# EAGLE design RAK4260_WCharging (EAGLE 9.6.2)
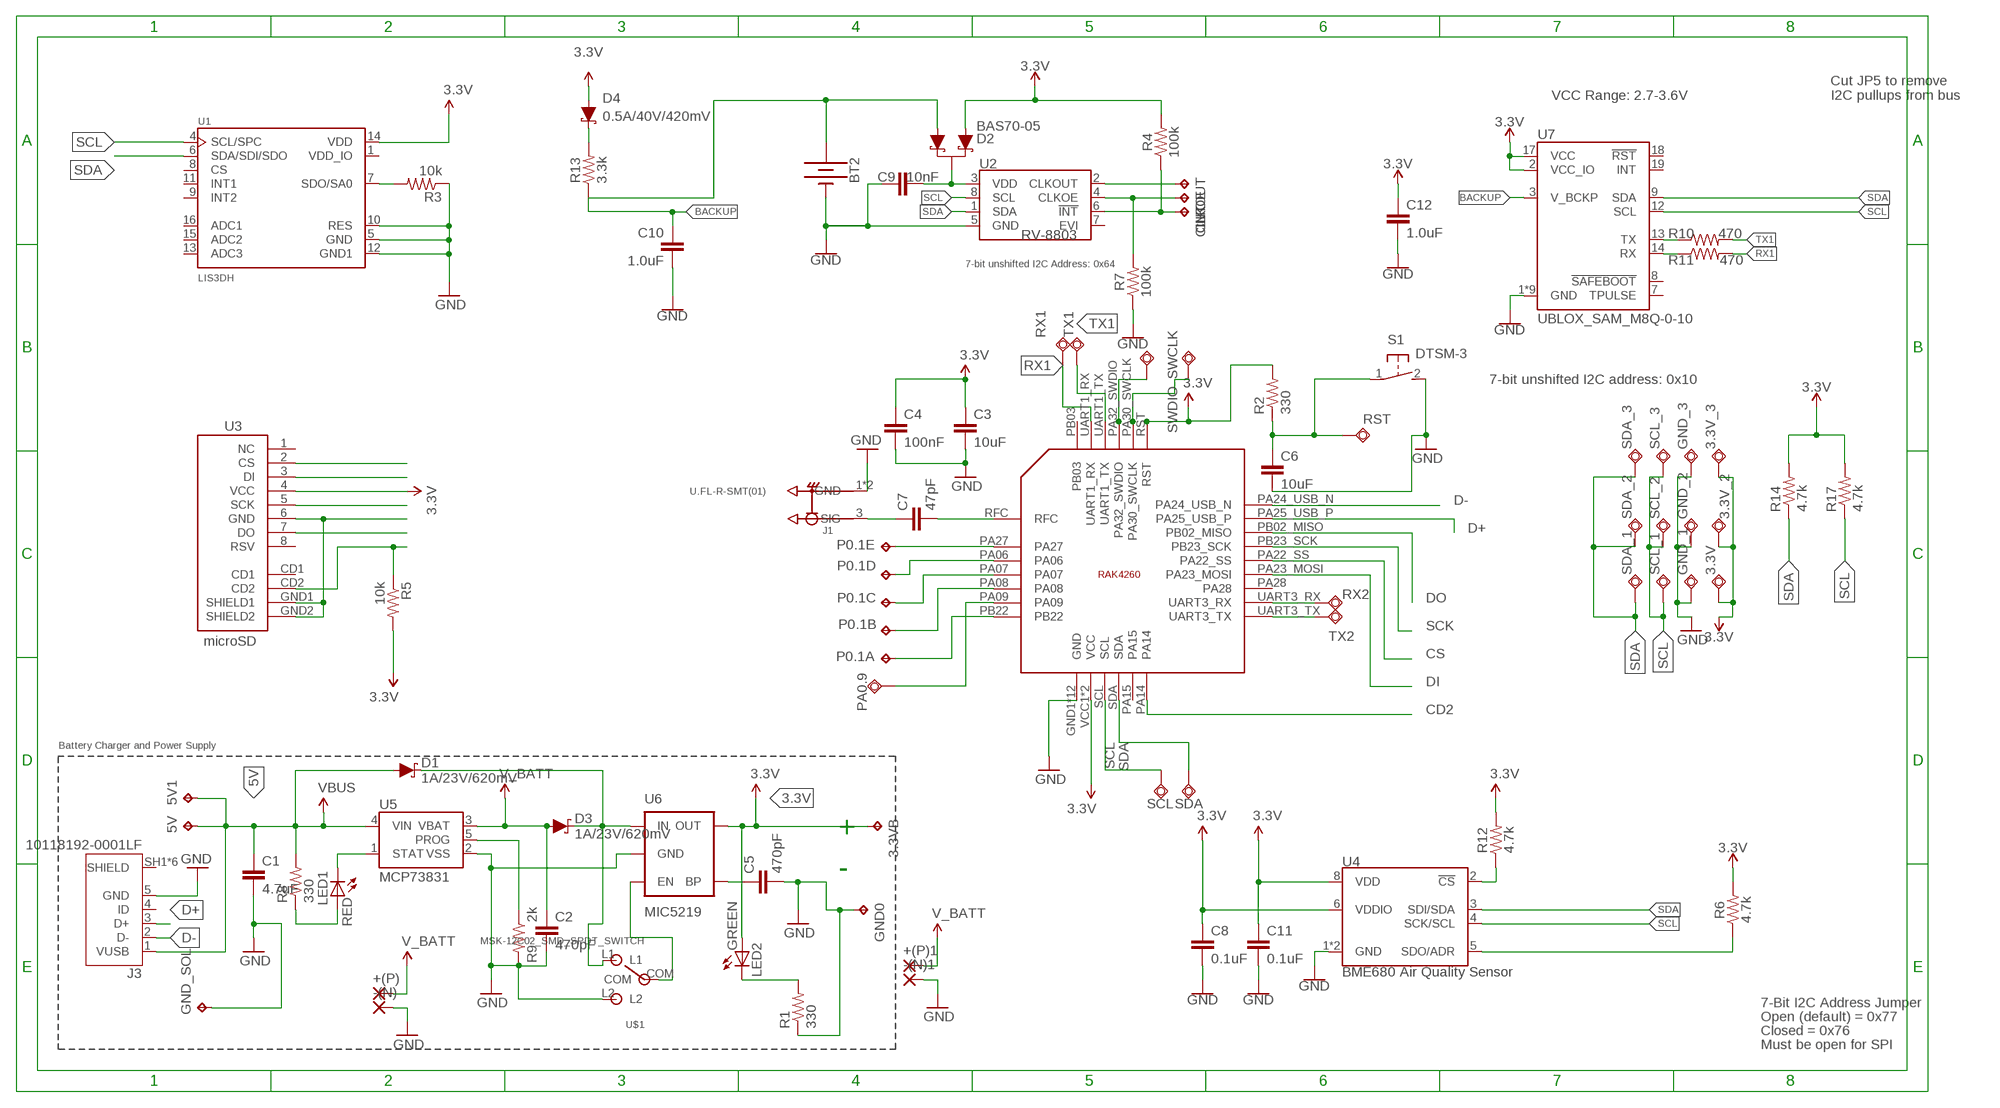
[diagram p0: schematic, sheet 1]

## Parts
3.3V  TPSQTP15R  [TP15R]
3.3V_2  TPSQTP15R  [TP15R]
3.3V_3  TPSQTP15R  [TP15R]
3.3VB  TPTP12SQ  [TP12SQ]
5V  TPTP12SQ  [TP12SQ]
5V1  TPTP12SQ  [TP12SQ]
+(P)  SMD2  [SMD1,27-2,54]
+(P)1  SMD2  [SMD1,27-2,54]
-(N)  SMD2  [SMD1,27-2,54]
-(N)1  SMD2  [SMD1,27-2,54]
BT2  BATTERY-12MM_SMD  [BATTCON_12MM]
C1  4.7uF  CAP0402-CAP  [0402-CAP]
C2  470pF  CAP0402-CAP  [0402-CAP]
C3  10uF  CAP0402-CAP  [0402-CAP]
C4  100nF  CAP0402-CAP  [0402-CAP]
C5  470pF  CAP0402-CAP  [0402-CAP]
C6  10uF  CAP0402-CAP  [0402-CAP]
C7  47pF  CAP0402-CAP  [0402-CAP]
C8  0.1uF  0.1UF-0603-100V-10%  [0603]
C9  10nF  10NF-0603-50V-10%  [0603]
C10  1.0uF  1.0UF-0603-16V-10%  [0603]
C11  0.1uF  0.1UF-0603-100V-10%  [0603]
C12  1.0uF  1.0UF-0603-16V-10%  [0603]
CLKOE  TPTP12R  [TP12R]
CLKOUT  TPTP12R  [TP12R]
D1  1A/23V/620mV  DIODE-SCHOTTKY-BAT20J  [SOD-323]
D2  BAS70-05  DIODE-SCHOTTKY-DUAL  [SOT23-3]
D3  1A/23V/620mV  DIODE-SCHOTTKY-BAT20J  [SOD-323]
D4  0.5A/40V/420mV  DIODE-SCHOTTKY-PMEG4005EJ  [SOD-323]
GND0  TPTP12SQ  [TP12SQ]
GND_1  TPSQTP15R  [TP15R]
GND_2  TPSQTP15R  [TP15R]
GND_3  TPSQTP15R  [TP15R]
GND_SOL  TPTP12SQ  [TP12SQ]
INT  TPTP12R  [TP12R]
J1  U.FL-R-SMT(01)  [HRS_U.FL-R-SMT(01)]
J3  10118192-0001LF  [AMPHENOL_10118192-0001LF]
LED1  RED  LED0603  [LED-0603@1]
LED2  GREEN  LED0603  [LED-0603@1]
P0.1  TP5P5-25-13  [P5-25-13]
PA0.9  TPSQTP15R  [TP15R]
R1  330  RESISTOR0402-RES  [0402-RES]
R2  330  RESISTOR0402-RES  [0402-RES]
R3  10k  330OHM1/10W1%(0603)  [0603-RES]
R4  100k  100KOHM-0603-1/10W-1%  [0603@2]
R5  10k  330OHM1/10W1%(0603)  [0603-RES]
R6  4.7k  4.7KOHM-0603-1/10W-1%  [0603@1]
R7  100k  100KOHM-0603-1/10W-1%  [0603@2]
R8  330  RESISTOR0402-RES  [0402-RES]
R9  2k  RESISTOR0603-RES  [0603-RES]
R10  470  470OHM-0603-1/10W-1%  [0603]
R11  470  470OHM-0603-1/10W-1%  [0603]
R12  4.7k  4.7KOHM-0603-1/10W-1%  [0603@1]
R13  3.3k  3.3KOHM-0603-1/10W-1%  [0603]
R14  4.7k  RESISTOR0402-RES  [0402-RES]
R17  4.7k  RESISTOR0402-RES  [0402-RES]
RST  TPSQTP19R  [TP19R]
RX1  TPSQTP15R  [TP15R]
RX2  TPSQTP15R  [TP15R]
S1  DTSM-3  [DTSM-3]
SCL  TPSQTP15R  [TP15R]
SCL_1  TPSQTP15R  [TP15R]
SCL_2  TPSQTP15R  [TP15R]
SCL_3  TPSQTP15R  [TP15R]
SDA  TPSQTP15R  [TP15R]
SDA_1  TPSQTP15R  [TP15R]
SDA_2  TPSQTP15R  [TP15R]
SDA_3  TPSQTP15R  [TP15R]
SWCLK  TPSQTP19R  [TP19R]
SWDIO  TPSQTP18R  [TP18R]
TX1  TPSQTP15R  [TP15R]
TX2  TPSQTP15R  [TP15R]
U1  LIS3DH  [PQFN50P300X300X100-16N]
U2  RV-8803  [RV-3028]
U3  microSD  USD-SOCKETSMD  [MICRO-SD-SOCKET-PP]
U4  BME680 Air Quality Sensor  BME680-LGA  [LGA3.0X3.0]
U5  MCP73831  [SOT23-5]
U6  MIC5219  V_REG_MIC52193.3V  [SOT23-5]
U7  UBLOX_SAM_M8Q-0-10  [SAM-M8Q]
U$1  MSK-12C02_SMD_SPDT_SWITCH  [MSK-12C02]
U$3  RAK4260  [RAK4260]

## Nets
3.3V: 3.3V.TP 3.3V_2.TP 3.3V_3.TP 3.3VB.TP C3.1 C4.1 C8.1 C11.1 C12.1 D2.1(A) D4.A LED2.A R2.2 R4.2 R5.2 R6.2 R12.2 R14.2 R17.2 U1.14(VDD) U3.4(VCC) U4.6(VDDIO) U4.8(VDD) U6.5(OUT) U7.2(VCC_IO) U7.17(VCC) U$3.RST U$3.VCC1(VCC) U$3.VCC2(VCC)
5V: 5V1.TP 5V.TP C1.1 D1.A J3.1(VUSB) R8.2 U5.4(VIN) ; supply symbol labelled VBUS
!CS: R12.1 U4.2(!CS)
!INT: INT.TP R4.1 U2.6(!INT)
BACKUP: BT2.PWR@1(+) C10.1 D2.2(A1) R13.1 U7.3(V_BCKP)
CD1: R5.1 U3.CD2
CD2: U$3.PA14
CLKOE: CLKOE.TP R7.2 U2.4(CLKOE)
CLKOUT: CLKOUT.TP U2.2(CLKOUT)
CS: U3.2(CS) U$3.PA22_SS
D+: J3.3(D+) U$3.PA25_USB_P
D-: J3.2(D-) U$3.PA24_USB_N
DI: U3.3(DI) U$3.PA23_MOSI
DO: U3.7(DO) U$3.PB02_MISO
GND: -(N)1.1(P) -(N).1(P) BT2.GND(-) C1.2 C2.2 C3.2 C4.2 C5.2 C6.2 C8.2 C9.1 C10.2 C11.2 C12.2 GND0.TP GND_1.TP GND_2.TP GND_3.TP GND_SOL.TP J1.1(GND) J1.2(GND) J3.5(GND) R1.1 R3.1 R7.1 R9.2 S1.2 U1.5(GND) U1.10(RES) U1.12(GND1) U2.5(GND) U4.1(GND) U4.7(GND) U5.2(VSS) U6.2(GND) U7.1(GND) U7.4(GND) U7.5(GND) U7.6(GND) U7.10(GND) U7.11(GND) U7.15(GND) U7.16(GND) U7.20(GND) U$1.L2 U$3.GND1(GND) U$3.GND3(GND) U$3.GND10(GND) U$3.GND17(GND) U$3.GND18(GND) U$3.GND28(GND) U$3.GND35(GND) U$3.GND36(GND) U$3.GND37(GND) U$3.GND38(GND) U$3.GND39(GND) U$3.GND40(GND)
GND1: U3.6(GND) U3.GND1(SHIELD1) U3.GND2(SHIELD2)
N$1: LED2.C R1.2
N$2: D1.C D3.C U6.1(IN) U$1.L1
N$3: C7.1 J1.3(SIG)
N$4: R9.1 U5.5(PROG)
N$5: U6.3(EN) U$1.COM
N$6: C7.2 U$3.RFC
N$7: C9.2 D2.3(C) U2.3(VDD)
N$8: SWDIO.TP U$3.PA32_SWDIO
N$10: PA0.9.TP U$3.PA09
N$12: LED1.A R8.1
N$13: LED1.C U5.1(STAT)
N$15: C5.1 U6.4(BP)
N$16: RX2.TP U$3.UART3_RX
N$17: P0.1.TP-5 U$3.PA27
N$18: P0.1.TP-4 U$3.PA06
N$19: R3.2 U1.7(SDO/SA0)
N$20: SWCLK.TP U$3.PA30_SWCLK
N$21: P0.1.TP-3 U$3.PA07
N$22: P0.1.TP-2 U$3.PA08
N$23: TX2.TP U$3.UART3_TX
N$24: D4.C R13.2
PB22: P0.1.TP-1 U$3.PB22
RST: C6.1 R2.1 RST.TP S1.1
RX1: R11.2 RX1.TP U$3.UART1_RX
RXLV: R11.1 U7.14(RX)
SCK: U3.5(SCK) U$3.PB23_SCK
SCL: R17.1 SCL.TP SCL_1.TP SCL_2.TP SCL_3.TP U1.4(SCL/SPC) U2.8(SCL) U4.4(SCK/SCL) U7.12(SCL) U$3.SCL
SDA: R14.1 SDA.TP SDA_1.TP SDA_2.TP SDA_3.TP U1.6(SDA/SDI/SDO) U2.1(SDA) U4.3(SDI/SDA) U7.9(SDA) U$3.SDA
SDO/ADR: R6.1 U4.5(SDO/ADR)
TX1: R10.2 TX1.TP U$3.UART1_TX
TXLV: R10.1 U7.13(TX)
V_BATT: +(P)1.1(P) +(P).1(P) C2.1 D3.A U5.3(VBAT)
Unconnected: J3.4(ID) J3.SH1(SHIELD) J3.SH2(SHIELD) J3.SH3(SHIELD) J3.SH4(SHIELD) J3.SH5(SHIELD) J3.SH6(SHIELD) U1.8(CS) U1.9(INT2) U1.11(INT1) U1.13(ADC3) U1.15(ADC2) U1.16(ADC1) U2.7(EVI) U3.1(NC) U3.8(RSV) U3.CD1 U7.7(TPULSE) U7.8(!SAFEBOOT) U7.18(!RST) U7.19(INT) U$3.PA15 U$3.PA28 U$3.PB03

## Notes on the sheet
- VCC Range: 2.7-3.6V
- Cut JP5 to remove 
  I2C pullups from bus
- 7-bit unshifted I2C Address: 0x64
- 7-bit unshifted I2C address: 0x10
- Battery Charger and Power Supply
- +
- -
- 7-Bit I2C Address Jumper
- Open (default) = 0x77
- Closed = 0x76
- Must be open for SPI

## Power pins joined to a net without a drawn wire
VDD_IO: U1.1(VDD_IO)

## Library data of the parts
3.3V 3.3V_2 3.3V_3 GND_1-GND_3 PA0.9 RX1 RX2 SCL SCL_1-SCL_3 SDA SDA_1-SDA_3 TX1 TX2 = testpad:TPSQ: Test pad
3.3VB 5V 5V1 GND0 GND_SOL = testpad:TP: Test pad; SPICEPREFIX: X
+(P) +(P)1 -(N) -(N)1 = wirepad:SMD2: SMD PAD
BT2 = SparkFun-Batteries:BATTERY: Battery - Single Cell A variety of battery chemistries, sizes, and footprints. Device List: 20MM_PTH - Coin Cell Battery Holder - 20mm (PTH) <https://www.sparkfun.com/products/783> 20MM_PTH_KIT- Coin Cell battery Holder - 20 mm (PTH) <http://www.sparkfun.com/products/783>kit version with special mask 6.8MM_PTH - Coin Cell Battery Holder - 6.8MM(SMD) <https://www.digikey.com/product-detail/en/seiko-instruments/MS621FE-FL11E/728-1057-ND/1889208?WT.srch=1&gclid=CNOQ5a6LzdQCFZS2wAodXCkE0g> 12MM_SMD - Coin Cell Battery Holder - 12mm (SMD) <https://www.sparkfun.com/products/10592> 12MM_PTH - Coin Cell Battery Holder - 12mm (PTH) <https://www.sparkfun.com/products/7948> 20MM_SMD - 20mm Coin Cell Battery Holder (SMD) (2 legs) Used on the Big Time Watch Kit <https://www.sparkfun.com/products/11734> 20MM_SMD_4LEGS - Coin Cell Battery Holder - 20mm (SMD) <https://www.sparkfun.com/products/11892> 20MM_SMD_4LEGS_OVERPASTE - Coin Cell Battery Holder - 20mm (SMD) <https://www.sparkfun.com/products/11892> (Over-paste on the legs) 24.5MM_PTH - Coin Cell Battery Holder - 24.5mm (PTH) <https://www.sparkfun.com/products/8863> 9V - 9V Battery Holder - PC Mount Used on the SparkFun SparkPunk Sound Kit <https://www.sparkfun.com/products/11177> and SparkFun SparkPunk Sequencer Kit <https://www.sparkfun.com/products/12707> 18650 - Battery Holder - 18650 (PTH) <https://www.sparkfun.com/products/13113> AA - Battery Holder - 1xAA (PTH) <https://www.sparkfun.com/products/7949> AAA - Battery Holder - 1xAAA (PTH) <https://www.sparkfun.com/products/12718> AA_KIT - Battery Holder - 1xAA (PTH) <https://www.sparkfun.com/products/7949> Special kit package - pads only have exposed copper on one side of the board. AAA_KIT - Battery Holder - 1xAAA (PTH) <https://www.sparkfun.com/products/12718> Special kit package - pads only have exposed copper on one side of the board.; PROD_ID: BATT-08044; SF_SKU: PRT-10592
C1-C7 = SparkFun-Passives:CAP: Capacitor Standard 0603 ceramic capacitor, and 0.1" leaded capacitor.; PROD_ID: CAP-07884
C8 C11 = SparkFun-Capacitors:0.1UF: 0.1µF ceramic capacitors A capacitor is a passive two-terminal electrical component used to store electrical energy temporarily in an electric field.; PROD_ID: CAP-08390
C9 = SparkFun-Capacitors:10NF: 0.01uF/10nF/10,000pF ceramic capacitors A capacitor is a passive two-terminal electrical component used to store electrical energy temporarily in an electric field. CAP-09321; PROD_ID: CAP-00867
C10 C12 = SparkFun-Capacitors:1.0UF: 1µF ceramic capacitors A capacitor is a passive two-terminal electrical component used to store electrical energy temporarily in an electric field.; PROD_ID: CAP-00868
CLKOE CLKOUT INT = testpad:TP: Test pad
D1 D3 = SparkFun-DiscreteSemi:DIODE-SCHOTTKY: Schottky diode A Schottky diode is a semiconductor diode which has a low forward voltage drop and a very fast switching action.; PROD_ID: DIO-11623
D2 = SparkFun-DiscreteSemi:DIODE-SCHOTTKY-DUAL: Diodes Incorporated - BAS70-05 Dual Schottky Diode Two Schottky Diodes in a single SOT-23 package. Low reverse current (100 nA) Vf: Datasheet referenced for footprint <https://www.diodes.com/assets/Datasheets/ds11007.pdf>; PROD_ID: DIO-14829
D4 = SparkFun-DiscreteSemi:DIODE-SCHOTTKY: Schottky diode A Schottky diode is a semiconductor diode which has a low forward voltage drop and a very fast switching action.; PROD_ID: DIO-10955
J1 = U.FL-R-SMT_01_:U.FL-R-SMT(01): U.FL Series 6 Ghz 50 Ohm Ultra-small SMT Coaxial Cable Receptacle Check prices <https://pricing.snapeda.com/search/part/U.FL-R-SMT%2801%29/?ref=eda>; AVAILABILITY: Warning; DESCRIPTION: U.FL (UMCC) Connector Receptacle, Male Pin 50Ohm Surface Mount Solder; MF: Hirose; MP: U.FL-R-SMT(01); PACKAGE: None; PRICE: None; PURCHASE-URL: https://pricing.snapeda.com/search/part/U.FL-R-SMT(01)/?ref=eda
J3 = 10118192-0001LF:10118192-0001LF: Single Port 5 Contact Horizontal Right Angle Shielded Micro B USB 2.0 Connector; AVAILABILITY: Unavailable; DESCRIPTION: USB - micro B USB 2.0 Receptacle Connector 5 Position Surface Mount, Right Angle; MF: Amphenol ICC; MP: 10118192-0001LF; PACKAGE: None; PRICE: None
LED1 LED2 = SparkFun-LED:LED: LEDs Standard schematic elements and footprints for 5mm, 3mm, 1206, and 0603 sized LEDs. 5mm - Spark Fun Electronics SKU : COM-00529 (and others); PROD_ID: DIO-00819
P0.1 = testpad:TP5: Test pad
R1 R2 R8 R14 R17 = SparkFun-Passives:RESISTOR: Resistor Basic schematic elements and footprints for 0603, 1206, and PTH resistors.; PROD_ID: RES-00818
R3 R5 = SparkFun-Resistors:330OHM1/10W1%(0603): RES-00818; PROD_ID: RES-00818; VALUE: 330
R4 R7 = SparkFun-Resistors:100KOHM: 100kΩ resistor A resistor is a passive two-terminal electrical component that implements electrical resistance as a circuit element. Resistors act to reduce current flow, and, at the same time, act to lower voltage levels within circuits. - Wikipedia; PROD_ID: RES-07828
R6 R12 = SparkFun-Resistors:4.7KOHM: 4.7kΩ resistor A resistor is a passive two-terminal electrical component that implements electrical resistance as a circuit element. Resistors act to reduce current flow, and, at the same time, act to lower voltage levels within circuits. - Wikipedia; PROD_ID: RES-07857
R9 = SparkFun-Resistors:RESISTOR: Resistor Basic schematic elements and footprints for 0603, 1206, and PTH resistors.; PROD_ID: RES-00824
R10 R11 = SparkFun-Resistors:470OHM: 470Ω resistor A resistor is a passive two-terminal electrical component that implements electrical resistance as a circuit element. Resistors act to reduce current flow, and, at the same time, act to lower voltage levels within circuits. - Wikipedia; PROD_ID: RES-07869
R13 = SparkFun-Resistors:3.3KOHM: 3.3kΩ resistor A resistor is a passive two-terminal electrical component that implements electrical resistance as a circuit element. Resistors act to reduce current flow, and, at the same time, act to lower voltage levels within circuits. - Wikipedia; PROD_ID: RES-07851
RST SWCLK SWDIO = testpad:TPSQ: Test pad; SPICEPREFIX: X
S1 = switch-tact:DTSM-3
U1 = LIS3DH (1):LIS3DH: MEMS digital output motion sensor ultra low-power high performance 3-axes "nano" accelerometer Check prices <https://pricing.snapeda.com/parts/LIS3DH/STMicroelectronics/view-part?ref=eda>; AVAILABILITY: Bad; DESCRIPTION: Accelerometer X, Y, Z Axis ±2g, 4g, 8g, 16g 0.5Hz ~ 625Hz 16-LGA (3x3); MF: STMicroelectronics; MP: LIS3DH; PACKAGE: LGA-16 STMicroelectronics; PRICE: None
U2 = SparkFun-Clocks:RV-8803: Micro Crystal RV-8803 - Temperature compensated RTC Ultra accurate plus/minus 3PPM I2C RTC. Temperature compensated crystal for low drift; PROD_ID: IC-14828
U3 = SparkFun:USD-SOCKET: microSD Socket Push-push type uSD socket. Schematic element and footprint production proven. Spark Fun Electronics SKU : PRT-00127. tDoc lines correctly indicate media card edge positions when inserting (unlocked, locked, depressed).
U4 = SparkFun-Sensors:BME680: Bosch BME680 – Combined Humidity and Pressure Sensor The BME680 is as combined digital humidity, pressure and temperature sensor based on proven sensing principles. The sensor module is housed in an extremely compact metal-lid LGA package with a footprint of only 3.0×3.0mm with a height of 0.93mm. Its small dimensions and its low power consumption allow the implementation in battery driven devices such as handsets, GPS modules or watches.; PROD_ID: IC-14656; VALUE: BME680
U5 = SparkFun-PowerIC:MCP73831: Miniature single cell, fully integrated Li-Ion, Li-polymer charge management controller http://ww1.microchip.com/downloads/en/DeviceDoc/21984a.pdf IC-09995; PROD_ID: IC-09995
U6 = SparkFun-PowerIC:V_REG_MIC5219: V_REG MIC5219 Standard 3.3V and 5V 500mA LDO voltage regulator in SOT-23 layout. Micrel part MIC5219. BP (by-pass) pin is used to lower output noise with 470pF cap, may be left open.; PROD_ID: VREG-09872; VALUE: MIC5219 3.3V
U7 = SparkFun-GPS:UBLOX_SAM_M8Q-0-10: u-blox SAM-M8Q The u-blox concurrent SAM-M8Q GNSS patch antenna module benefits from the exceptional performance of the u-blox M8 multi-GNSS engine. The SAM-M8Q module offers high sensitivity and minimal acquisition times in an ultra compact form factor. The SAM-M8Q module utilizes concurrent reception of up to three GNSS systems (GPS/Galileo and GLONASS), recognizes multiple constellations simultaneously and provides outstanding positioning accuracy in scenarios where urban canyon or weak signals are involved. For even better and faster positioning improvement, the SAM-M8Q supports augmentation of QZSS, GAGAN and IMES together with WAAS, EGNOS, MSAS. The SAM-M8Q also supports message integrity protection, geofencing, and spoofing detection with configurable interface settings to easily fit to customer applications.; PROD_ID: IC-14070
U$1 = MSK-12C02 SMD Micro Slider Switch SPDT:MSK-12C02_SMD_SPDT_SWITCH: Footprint of the VIMEX MSK-12C02 SPDT SMD Switch Created by mzst on 17-Jan-2016
U$3 = RAK4260:RAK4260: RAK4260 LoRaWAN module from RAKwireless.

## Net classes
0 default: width 0.254 mm
1 power: width 0.254 mm

## Board
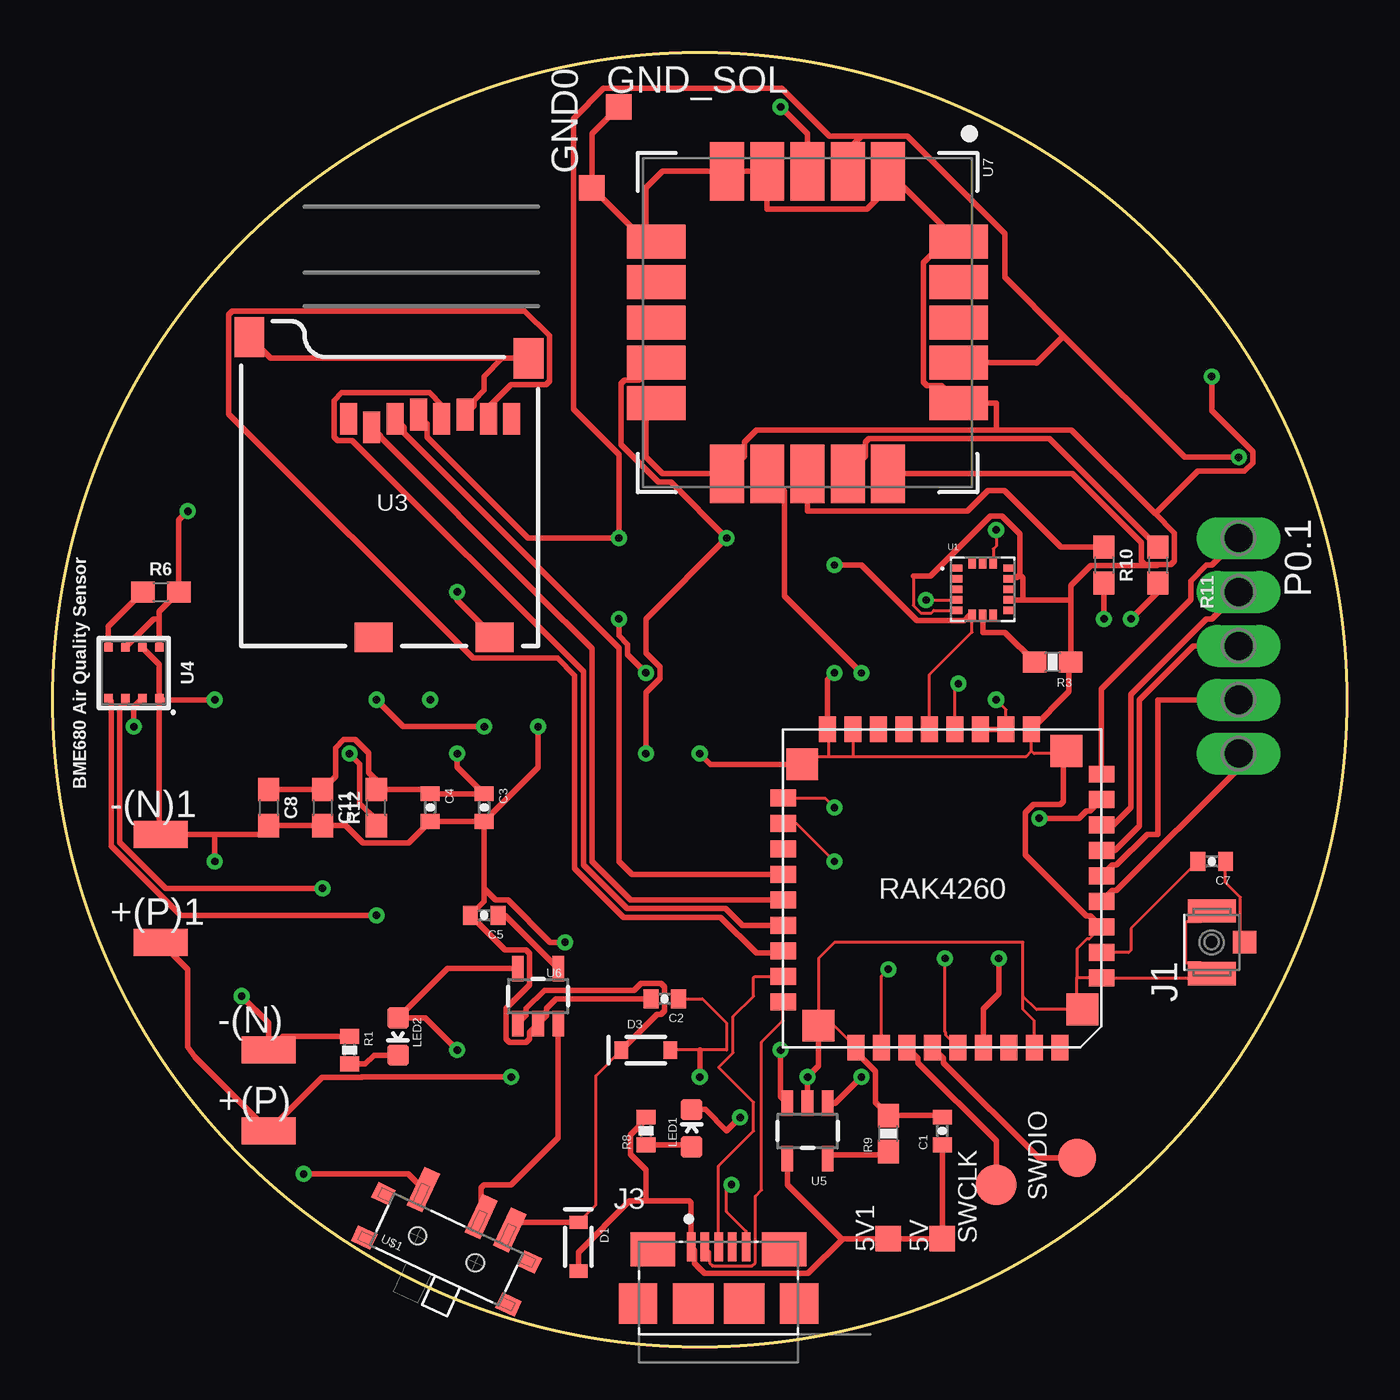
[diagram p1: board, top side]
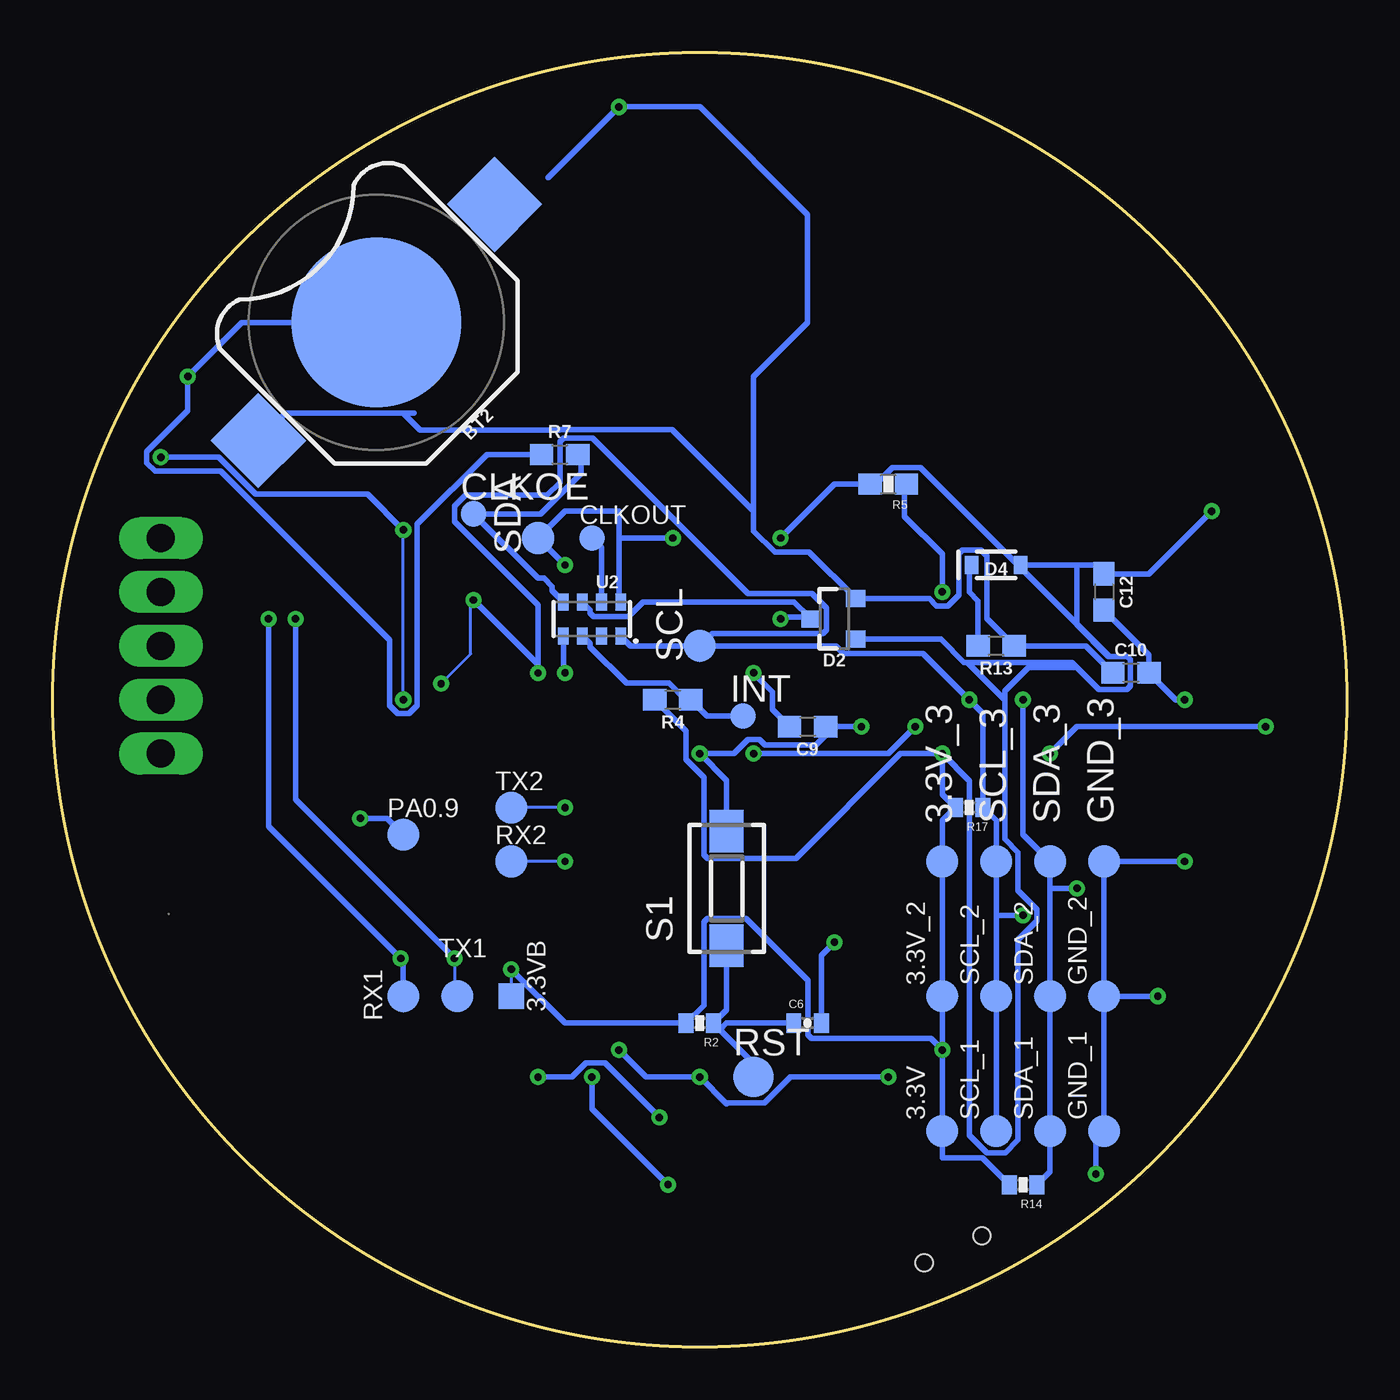
[diagram p2: board, bottom side, seen from below]

Size 60.96 x 60.96 mm. Coordinates in mm from the lower left corner, seen from the top.
Outline: circle at 30.48,30.48 radius 30.48
Copper layers (1*16): Top 0.035mm / dielectric 1.5mm / Bottom 0.035mm
Design rules "default": minimum track width 6mil, minimum drill 0.35mm, track to track 6mil, track to pad 6mil, pad to pad 6mil, via to via 6mil, smd to smd 6mil, copper to edge 40mil, drill to drill 6mil, minimum pad ring 10mil, minimum via ring 8mil, stop-mask expansion 4mil, vias tented up to drill 0mil, thermal gap 10mil

### Footprints (pad centres in the part's own frame; a part is rotated, then mirrored left to right if it is on the bottom)
TP15R = smd 1.5 x 1.5: TP 0,0
TP12SQ = smd 1.2 x 1.2: TP 0,0
SMD1,27-2,54 = smd 1.27 x 2.54: 1 0,0
BATTCON_12MM = smd 8 x 8: GND 0,0 | smd 3.175 x 3.175: PWR@1 -7.874,0; PWR@2 7.874,0
0402-CAP = smd 0.7 x 0.9: 1 -0.65,0; 2 0.65,0
0603 = smd 1.1 x 1: 1 -0.85,0; 2 0.85,0
TP12R = smd 1.2 x 1.2: TP 0,0
SOD-323 = smd 0.63 x 0.83: A 1.15,0; C -1.15,0
SOT23-3 = smd 0.8 x 0.9: 1 -0.95,-1; 2 0.95,-1; 3 0,1.1
HRS_U.FL-R-SMT(01) = smd 1.1 x 2.25: 1 -1.475,0; 2 1.475,0 | smd 1.05 x 1.1: 3 0,-1.55
AMPHENOL_10118192-0001LF = smd 0.4 x 1.35: 1 -1.3,0; 2 -0.65,0; 3 0,0; 4 0.65,0; 5 1.3,0 | smd 2.1 x 1.6: SH1 -3.1,-0.125; SH2 3.1,-0.125 | smd 1.8 x 1.9: SH3 -3.8,-2.675; SH6 3.8,-2.675 | smd 1.9 x 1.9: SH4 -1.2,-2.675; SH5 1.2,-2.675
LED-0603@1 = smd 1 x 1: A 0,-0.877; C 0,0.877
P5-25-13 = drill 1.321 pad 1.905 long: TP-1 -5.08,0; TP-2 -2.54,0; TP-3 0,0; TP-4 2.54,0; TP-5 5.08,0
0402-RES = smd 0.7 x 0.9: 1 -0.65,0; 2 0.65,0
0603-RES = smd 1.1 x 1: 1 -0.85,0; 2 0.85,0
0603@2 = smd 1.1 x 1: 1 -0.85,0; 2 0.85,0
0603@1 = smd 1.1 x 1: 1 -0.85,0; 2 0.85,0
TP19R = smd 1.9 x 1.9: TP 0,0
DTSM-3 = smd 2 x 1.6: 1 -2.7,0; 2 2.7,0
TP18R = smd 1.8 x 1.8: TP 0,0
PQFN50P300X300X100-16N = smd 0.52 x 0.35: 1 -1.225,1; 2 -1.225,0.5; 3 -1.225,0; 4 -1.225,-0.5; 5 -1.225,-1; 9 1.225,-1; 10 1.225,-0.5; 11 1.225,0; 12 1.225,0.5; 13 1.225,1 | smd 0.35 x 0.52: 6 -0.5,-1.225; 7 0,-1.225; 8 0.5,-1.225; 14 0.5,1.225; 15 0,1.225; 16 -0.5,1.225
RV-3028 = smd 0.5 x 0.8: 1 -1.35,-0.8; 2 -0.45,-0.8; 3 0.45,-0.8; 4 1.35,-0.8; 5 1.35,0.8; 6 0.45,0.8; 7 -0.45,0.8; 8 -1.35,0.8
MICRO-SD-SOCKET-PP = smd 0.8 x 1.5: 1 -8.94,10.7; 2 -7.84,10.3; 3 -6.74,10.7; 4 -5.64,10.9; 5 -4.54,10.7; 6 -3.44,10.9; 7 -2.34,10.7; 8 -1.24,10.7 | smd 1.8 x 1.4: CD1 -7.75,0.4; CD2 -2.05,0.4 | smd 1.4 x 1.9: GND1 -13.6,14.55; GND2 -0.45,13.55
LGA3.0X3.0 = smd 0.4 x 0.4: 1 1.2,1.2; 2 1.2,0.4; 3 1.2,-0.4; 4 1.2,-1.2; 5 -1.2,-1.2; 6 -1.2,-0.4; 7 -1.2,0.4; 8 -1.2,1.2
SOT23-5 = smd 0.55 x 1.2: 1 -0.95,-1.3; 2 0,-1.3; 3 0.95,-1.3; 4 0.95,1.3; 5 -0.95,1.3
SAM-M8Q = smd 2.75 x 1.6: 1 -7.125,3.8; 2 -7.125,1.9; 3 -7.125,0; 4 -7.125,-1.9; 5 -7.125,-3.8; 11 7.125,-3.8; 12 7.125,-1.9; 13 7.125,0; 14 7.125,1.9; 15 7.125,3.8 | smd 1.6 x 2.75: 6 -3.8,-7.125; 7 -1.9,-7.125; 8 0,-7.125; 9 1.9,-7.125; 10 3.8,-7.125; 16 3.8,7.125; 17 1.9,7.125; 18 0,7.125; 19 -1.9,7.125; 20 -3.8,7.125
MSK-12C02 = smd 0.8 x 2: COM 0.823,2.1; L1 2.323,2.1; L2 -2.177,2.1 | smd 1 x 0.8: GND@1 -3.75,-1.125; GND@4 3.75,-1.125 | smd 0.9 x 0.8: GND@2 -3.8,1.125; GND@3 3.8,1.125 | hole 0.8: -1.5,0; 1.5,0
RAK4260 = smd 1.2 x 0.8: GND1 -7.5,4.22; GND3 -7.5,1.82; PA06 -7.5,-0.58; PA07 -7.5,-1.78; PA08 -7.5,-2.98; PA09 -7.5,-4.18; PA22_SS 7.5,0.55; PA23_MOSI 7.5,-0.65; PA24_USB_N 7.5,5.35; PA25_USB_P 7.5,4.15; PA27 -7.5,0.62; PA28 7.5,-1.85; PB02_MISO 7.5,2.95; PB22 -7.5,-5.38; PB23_SCK 7.5,1.75; RFC -7.5,3.02; UART3_RX 7.5,-3.05; UART3_TX 7.5,-4.25 | smd 0.8 x 1.2: GND10 -4.2,-7.5; GND17 4.2,-7.5; GND18 5.4,-7.5; GND28 4.06,7.5; GND35 -4.34,7.5; GND36 -5.54,7.5; PA14 3,-7.5; PA15 1.8,-7.5; PA30_SWCLK 1.66,7.5; PA32_SWDIO 0.46,7.5; PB03 -3.14,7.5; RST 2.86,7.5; SCL -0.6,-7.5; SDA 0.6,-7.5; UART1_RX -1.94,7.5; UART1_TX -0.74,7.5; VCC1 -3,-7.5; VCC2 -1.8,-7.5 | smd 1.5 x 1.5: GND37 -5.85,-6.48; GND38 6.6,-5.85; GND39 5.83,6.47; GND40 -6.61,5.71

### Placement (x,y rotation side)
3.3V  19.05,10.16 90 bottom
3.3V_2  19.05,16.51 90 bottom
3.3V_3  19.05,22.86 90 bottom
3.3VB  39.37,16.51 0 bottom
5V  41.91,5.08 0 top
5V1  39.37,5.08 0 top
+(P)  10.16,10.16 270 top
+(P)1  5.08,19.05 270 top
-(N)  10.16,13.97 270 top
-(N)1  5.08,24.13 270 top
BT2  45.72,48.26 45 bottom
C1  41.91,10.16 90 top
C2  28.83,16.38 180 top
C3  20.32,25.4 270 top
C4  17.78,25.4 270 top
C5  20.32,20.32 180 top
C6  25.4,15.24 0 bottom
C7  54.61,22.86 180 top
C8  10.16,25.4 270 top
C9  25.4,29.21 180 bottom
C10  10.16,31.75 0 bottom
C11  12.7,25.4 270 top
C12  11.43,35.56 270 bottom
CLKOE  41.15,39.24 0 bottom
CLKOUT  35.56,38.1 0 bottom
D1  24.77,4.7 270 top
D2  24.13,34.29 90 bottom
D3  27.94,13.97 0 top
D4  16.51,36.83 0 bottom
GND0  25.4,54.61 0 top
GND_1  11.43,10.16 90 bottom
GND_2  11.43,16.51 90 bottom
GND_3  11.43,22.86 0 bottom
GND_SOL  26.67,58.42 0 top
INT  28.45,29.72 0 bottom
J1  54.61,19.05 90 top
J3  31.37,4.7 0 top
LED1  30.1,10.29 0 top
LED2  16.26,14.6 180 top
P0.1  55.88,33.02 270 top
PA0.9  44.45,24.13 0 bottom
R1  13.97,13.97 270 top
R2  30.48,15.24 180 bottom
R3  47.12,32.26 180 top
R4  31.75,30.48 180 bottom
R5  21.59,40.64 180 bottom
R6  5.08,35.56 0 top
R7  37.08,42.04 0 bottom
R8  27.94,10.16 90 top
R9  39.37,10.03 90 top
R10  49.53,36.83 270 top
R11  52.07,36.83 270 top
R12  15.24,25.4 90 top
R13  16.51,33.02 180 bottom
R14  15.24,7.62 180 bottom
R17  17.78,25.4 180 bottom
RST  27.94,12.7 0 bottom
RX1  44.45,16.51 0 bottom
RX2  39.37,22.86 0 bottom
S1  29.21,21.59 90 bottom
SCL  30.48,33.02 90 bottom
SCL_1  16.51,10.16 90 bottom
SCL_2  16.51,16.51 0 bottom
SCL_3  16.51,22.86 90 bottom
SDA  38.1,38.1 90 bottom
SDA_1  13.97,10.16 90 bottom
SDA_2  13.97,16.51 90 bottom
SDA_3  13.97,22.86 0 bottom
SWCLK  44.45,7.62 0 top
SWDIO  48.26,8.89 0 top
TX1  41.91,16.51 0 bottom
TX2  39.37,25.4 0 bottom
U1  43.82,35.69 0 top
U2  35.56,34.29 180 bottom
U3  22.86,33.02 0 top
U4  3.81,31.75 270 top
U5  35.56,10.16 180 top
U6  22.86,16.51 0 top
U7  35.56,48.26 270 top
U$1  18.54,4.57 335 top
U$3  41.91,21.59 180 top

### Tracks (layer width: path | path; a pad name or v marks a point on that pad's centre or on a via)
3.3V  (via drill 0.35)
  Top 0.152: U$3.RST 39.05,17.46 v39.37,17.78 | U$3.VCC1 44.91,30.02 v44.45,30.48 | v44.45,38.48 44.45,37.72 44.32,37.58 U1.14
  Top 0.254: U6.5 18.58,17.81 LED2.A 17.54,15.48 v19.05,13.97 | U4.8 5.01,34.29 | 5.01,34.29 5.01,34.64 R6.2 5.93,38.95 v6.35,39.37 | U4.6 4.75,34.29 5.01,34.29 | C8.1 C11.1 13.31,26.86 13.31,28.21 13.7,28.6 14.24,28.6 14.87,27.97 14.87,27.04 15.24,26.67 R12.2 17.58,26.25 C4.1 C3.1 19.05,27.32 v19.05,27.94 | 37.46,56.51 U7.2 37.46,56.4 38.1,57.04 | 47.62,47.62 44.86,50.39 44.86,52.46 40.28,57.04 38.1,57.04 | 47.62,47.62 46.36,46.36 46.35,46.36 U7.17 | U3.4 17.64,43.5 17.64,42.85 22.4,38.1 v26.67,38.1 26.67,42.03 24.52,44.18 24.52,57.87 25.95,59.3 34.34,59.3 36.6,57.04 38.1,57.04 | U$3.VCC1 U$3.VCC2 | v55.88,41.91 53.34,41.91 47.62,47.62
  Bottom 0.152: v39.37,17.78 3.3VB.TP | v44.45,30.48 v44.45,38.48
  Bottom 0.254: v19.05,13.97 3.3V_2.TP 3.3V_3.TP 19.05,24.78 R17.2 19.05,26.02 v19.05,27.94 | v19.05,13.97 3.3V.TP 19.05,8.89 17.16,8.89 R14.2 | D4.A 12.7,36.83 | 12.7,36.83 11.85,36.83 C12.1 9.31,36.41 v6.35,39.37 | v26.67,38.1 24.13,40.64 R5.2 22.19,40.64 21.41,41.42 20.07,41.42 11.18,32.53 | v55.88,41.91 53.15,41.91 51.4,40.17 46.14,40.17 v44.45,38.48 | v19.05,13.97 19.59,14.51 25.22,14.51 25.38,14.67 25.38,17.25 28.29,20.17 30.13,20.17 30.29,20.01 30.29,16.08 R2.2 36.83,15.24 v39.37,17.78 | 11.18,32.53 11.22,32.53 12.7,34.02 12.7,36.83 | v19.05,27.94 17.76,26.65 17.76,9.95 16.94,9.13 16.08,9.13 15.48,9.73 15.48,19.15 14.58,20.05 14.58,20.59 15.48,21.49 15.48,23.29 16.1,23.91 16.1,30.48 | 16.1,30.48 16.1,30.89 14.99,32 12.71,32 | 12.71,32 11.68,30.97 10.34,30.97 10.18,31.13 10.18,32.37 10.34,32.53 11.18,32.53 | 16.1,30.48 17.86,32.24 | 17.86,32.24 18.03,32.24 19.13,33.34 D2.1 | 12.71,32 12.95,32.24 17.86,32.24 | v19.05,27.94 21.02,27.94 25.95,23.01 30.13,23.01 30.29,23.17 30.29,26.82 31.14,27.67 31.14,29.02 R4.2
5V
  Top 0.254: 27.94,6.86 29.97,6.86 30.07,6.76 J3.1 30.24,4.53 30.24,3.91 30.71,3.44 35.58,3.44 37.22,5.08 5V1.TP | 27.94,6.86 27.18,6.86 24.77,4.44 D1.A | 27.94,6.86 27.94,8.31 27.21,9.04 27.21,9.98 27.94,10.7 R8.2 | 5V1.TP 37.15,5.08 34.61,7.62 U5.4 | 5V1.TP 5V.TP C1.1
!CS  (via drill 0.35)
  Top 0.254: U4.2 3.81,30.15 v3.81,29.21 | v13.97,27.94 14.46,27.45 14.46,25.58 15.24,24.8 R12.1
  Bottom 0.254: v3.81,29.21 12.7,29.21 v13.97,27.94
!INT
  Bottom 0.254: U2.6 35.64,33.12 35.64,32.97 33.92,31.26 31.93,31.26 31.16,30.48 R4.1 30.14,29.72 INT.TP
BACKUP  (via drill 0.35)
  Top 0.254: v34.29,58.42 35.56,57.15 U7.3
  Bottom 0.254: BT2.PWR@1 50,43.98 44.45,43.98 | 44.45,43.98 43.95,43.98 | 37.63,55.08 v34.29,58.42 30.48,58.42 25.4,53.34 25.4,48.26 27.94,45.72 27.94,39.37 | C10.1 12.28,33.02 R13.1 16.95,34.31 16.95,37.25 17.23,37.52 18.09,37.52 18.25,37.36 18.25,35.43 18.78,34.9 19.32,34.9 19.66,35.24 D2.2 25.33,37.44 26.94,37.44 27.94,38.44 27.94,39.37 | 27.94,39.37 31.79,43.22 37.07,43.22 37.11,43.18 43.65,43.18 44.45,43.98
CD1  (via drill 0.35)
  Top 0.254: U3.CD2 19.05,35.18 v19.05,35.56
  Bottom 0.254: v19.05,35.56 19.05,37.34 20.83,39.12 20.83,40.55 R5.1
CLKOE
  Bottom 0.254: U2.4 37.44,35.62 37.44,35.82 37.83,36.21 38.11,36.21 CLKOE.TP 37.97,39.24 36.07,41.15 36.07,41.87 R7.2
CLKOUT
  Bottom 0.254: U2.2 35.11,37.65 CLKOUT.TP
CS
  Top 0.254: U3.2 15.44,42.9 15.44,42.85 22.8,35.5 25.4,32.89 25.4,22.86 27.22,21.04 U$3.PA22_SS
D+
  Top 0.152: U$3.PA25_USB_P 33.06,17.44 33.02,17.4 33.02,16.51 32.06,15.54 32.06,13.84 31.37,13.16 33.02,11.51 33.02,10.16 31.37,8.51 J3.3
D-
  Top 0.152: J3.2 30.94,4.48 30.94,3.93 31.07,3.79 32.96,3.79 33.1,3.93 33.1,7.08 33.4,7.38 33.4,14.35 34.41,15.36 U$3.PA24_USB_N
DI
  Top 0.254: U3.3 16.54,43.3 16.54,43.05 26.67,32.92 26.67,22.86 27.29,22.24 U$3.PA23_MOSI
DO
  Top 0.254: U3.7 20.52,44.27 21.59,45.34 23.23,45.34 23.39,45.5 23.39,47.64 22.23,48.8 8.44,48.8 8.28,48.64 8.28,43.95 19.79,32.44 23.78,32.44 24.59,31.63 24.59,22.52 26.88,20.23 31.46,20.23 33.15,18.54 34.31,18.54 U$3.PB02_MISO
GND  (via drill 0.35)
  Top 0.152: 41.84,10.88 C1.2 | U$3.GND28 36.82,15.12 U$3.GND39 36.08,18.3 36.83,19.05 45.72,19.05 45.72,16.51 | 45.72,16.51 45.72,15.87 46.25,15.34 U$3.GND35 U$3.GND36 | 45.72,16.51 46.35,15.88 U$3.GND40 48.26,16.14 48.26,17.4 | 48.26,17.4 49.38,17.4 U$3.GND1 54.41,17.37 J1.1 54.11,18.07 53.43,18.07 53.38,18.11 53.38,19.98 53.43,20.03 54.11,20.03 J1.2 | U$3.GND3 48.84,19.2 48.72,19.2 48.26,18.74 48.26,17.4 | U$3.GND37 47.63,27.94 46.23,27.94 46.11,28.06 | 46.11,28.06 U$3.GND10 | U$3.GND38 35.68,27.81 36.58,27.81 | 36.58,27.81 36.58,29.02 U$3.GND18 | 36.58,27.81 37.72,27.81 | 37.72,27.81 U$3.GND17 | 37.72,27.81 45.87,27.81 46.11,28.06 | U1.5 41.51,34.69 41.4,34.57 40.9,34.57 40.54,34.93 40.54,36.32 | J3.5 32.67,5.43 31.75,6.35 31.75,7.39 v31.98,7.62
  Top 0.254: C2.2 23.71,16.38 23.26,15.93 23.26,15.61 U6.2 22.46,14.81 22.46,14.49 22.3,14.33 21.52,14.33 21.36,14.49 21.36,15.93 22.46,17.03 22.46,18.53 22.3,18.69 21.3,18.69 C5.2 20.32,20.97 20.32,21.59 | 20.32,21.59 C3.2 | v8.89,16.51 10.16,15.24 -(N).1 10.81,14.62 R1.1 | C3.2 C4.2 16.75,23.72 14.62,23.72 13.8,24.55 C11.2 C8.2 9.74,24.13 7.62,24.13 | 7.62,24.13 -(N)1.1 5.01,24.2 U4.1 | U4.7 5.01,32.15 U4.1 | U7.1 39.75,54.99 | 39.75,54.99 42.29,52.45 | 42.29,52.45 U7.20 | 39.75,54.99 38.35,53.59 33.66,53.59 33.66,53.6 U7.4 U7.5 28.71,55.39 27.94,54.61 27.94,52.56 U7.6 27.95,52.06 GND0.TP 25.4,57.15 GND_SOL.TP | U7.10 27.94,43.97 27.94,41.91 28.71,41.13 U7.11 32.58,41.96 32.58,42.63 33.15,43.2 44.45,43.2 | U4.1 5.08,30.48 v7.62,30.48 | 52.07,36.85 52.69,36.85 52.85,37.01 52.85,38.35 51.95,39.25 | 52.07,36.85 51.45,36.85 51.29,37.01 51.29,37.88 48.04,41.13 U7.15 | 44.45,43.2 48,43.2 51.95,39.25 | 44.45,43.2 44.45,44.45 U7.16 41.86,45.28 41.19,45.28 41.03,45.44 41.03,51.08 42.29,52.34 42.29,52.45 | v7.62,22.86 7.62,24.13 | U$3.GND39 36.08,13.22 v35.56,12.7 U5.2 | v22.86,29.21 22.86,27.29 C3.2 | U$3.GND38 30.98,27.44 v30.48,27.94 | U$3.GND18 36.51,31.43 v36.83,31.75 | 41.84,10.88 R9.2 38.76,11.49 38.76,12.97 37.85,13.88 U$3.GND28 | 52.07,36.85 52.03,36.81 48.91,36.81 47.97,35.86 47.97,35.18 | 51.95,39.25 53.95,41.25 56.15,41.25 56.54,41.64 56.54,42.18 54.61,44.11 v54.61,45.72 | U$1.L2 16.72,8.13 v11.81,8.13 | 45.58,36.37 45.58,38.28 44.72,39.14 44.18,39.14 41.36,36.32 40.54,36.32 | U1.10 45.72,35.19 | 45.72,35.19 47.96,35.19 47.97,35.18 | U1.12 45.09,36.23 45.42,36.23 45.55,36.37 45.58,36.37
  Top 0.254: 45.58,36.37 45.72,36.23 45.72,35.19 | 20.32,21.59 20.86,21.05 21.44,21.05 23.44,19.05 v24.13,19.05 | U$3.GND3 48.89,20.29 48.69,20.29 45.82,23.16 45.82,25.16 46.21,25.55 47.48,25.55 47.62,25.69 47.62,27.93 47.63,27.94 | U$3.GND10 47.88,30.86 47.88,32.17 R3.1 47.97,35.18
  Bottom 0.254: GND_2.TP GND_1.TP 11.81,9.78 v11.81,8.13 | GND_2.TP GND_3.TP v7.62,22.86 | GND_2.TP v8.89,16.51 | C12.2 9.31,32.59 C10.2 8.04,30.48 v7.62,30.48 | v22.86,29.21 24.13,29.21 | 24.13,29.21 C9.1 | 24.13,29.21 24.99,28.35 27.42,28.35 27.67,28.6 28.21,28.6 28.87,27.94 v30.48,27.94 29.21,26.67 S1.2 | U2.5 36.91,31.83 v36.83,31.75 | v31.98,7.62 35.56,11.2 v35.56,12.7 | BT2.GND 52.07,48.26 v54.61,45.72 54.61,44.11 56.54,42.18 56.54,41.64 56.15,41.25 53.06,41.25 45.11,33.3 45.11,30.21 44.72,29.82 44.18,29.82 43.79,30.21 43.79,38.75 40.51,42.04 R7.1 | C6.2 24.75,18.43 v24.13,19.05
GND1
  Top 0.254: U3.6 19.84,44.34 19.84,44.59 20.32,45.06 20.32,45.72 21.17,46.57 U3.GND2 10.26,46.57 U3.GND1
N$1
  Top 0.254: R1.2 14.72,13.32 15.13,13.73 LED2.C
N$2
  Top 0.152: D3.C 26.73,13.91 25.58,12.76 25.58,6.67 D1.C
  Top 0.254: U6.1 22.31,15.61 22.31,15.93 23.17,16.79 27.39,16.79 27.71,17.11 28.65,17.11 28.81,16.95 28.81,15.82 28.65,15.65 28.47,15.65 26.73,13.91 | U$1.L1 21.89,5.85 D1.C
N$3
  Top 0.152: C7.1 55.26,21.87 55.96,21.17 55.96,19.25 J1.3
N$4
  Top 0.152: 36.69,9.03 U5.5
  Top 0.254: R9.1 39.22,9.03 36.69,9.03
N$5
  Top 0.254: U6.3 23.81,9.84 21.59,7.62 20.32,7.62 20.18,7.47 U$1.COM
N$6
  Top 0.152: C7.2 50.8,19.7 50.8,18.67 50.7,18.57 U$3.RFC
N$7  (via drill 0.35)
  Top 0.254: v27.94,31.75 27.08,32.61 27.08,33.09 26.67,33.5 v26.67,34.29
  Bottom 0.254: 25.32,34.38 26.03,35.09 33.17,35.09 33.84,34.41 35.48,34.41 35.64,34.57 35.64,34.72 U2.3 | 25.32,34.38 D2.3 | C9.2 27.06,30.02 27.06,30.84 27.94,31.72 v27.94,31.75 | v26.67,34.29 26.59,34.38 25.32,34.38
N$8
  Top 0.254: U$3.PA32_SWDIO 41.97,13.57 41.97,13.37 46.46,8.89 SWDIO.TP
N$10  (via drill 0.35)
  Top 0.254: U$3.PA09 48.89,25.25 48.69,25.25 48.34,24.89 v46.48,24.89
  Bottom 0.254: PA0.9.TP 45.21,24.89 v46.48,24.89
N$12
  Top 0.254: R8.1 30,9.51 LED1.A
N$13  (via drill 0.35)
  Top 0.254: LED1.C 30.75,11.16 31.75,10.16 v32.39,10.79 | v38.1,12.7 36.86,11.46 U5.1
  Bottom 0.254: v38.1,12.7 36.49,12.7 35.83,13.36 34.95,13.36 v32.39,10.79
N$15
  Top 0.254: U6.4 21.3,20.32 C5.1
N$16  (via drill 0.35)
  Top 0.152: U$3.UART3_RX 35.05,24.64 v36.83,22.86
  Bottom 0.152: v36.83,22.86 RX2.TP
N$17
  Top 0.254: U$3.PA27 49.93,21.49 50.13,21.49 55.88,27.25 P0.1.TP-5
N$18
  Top 0.254: U$3.PA06 49.93,22.69 50.13,22.69 51.57,24.13 52.07,24.13 52.07,30.48 P0.1.TP-4
N$19
  Top 0.254: R3.2 44.87,33.66 43.82,33.66 U1.7
N$20
  Top 0.152: 40.51,13.83 U$3.PA30_SWCLK
  Top 0.254: 40.51,13.83 40.77,13.57 40.77,13.37 44.45,9.69 SWCLK.TP
N$21
  Top 0.254: U$3.PA07 50.04,23.37 51.21,24.54 51.21,30.48 53.75,33.02 P0.1.TP-3
N$22
  Top 0.254: U$3.PA08 49.97,24.57 50.8,25.4 50.8,30.73 54.36,34.29 54.61,34.29 P0.1.TP-2
N$23  (via drill 0.35)
  Top 0.152: U$3.UART3_TX 36.39,25.84 v36.83,25.4
  Bottom 0.152: v36.83,25.4 TX2.TP
N$24
  Bottom 0.254: R13.2 17.36,35.14 17.78,35.56 17.78,36.71 D4.C
PB22
  Top 0.254: P0.1.TP-1 54.61,36.83 54.36,36.83 53.62,36.09 53.62,35.19 49.41,30.99 U$3.PB22
RST
  Bottom 0.254: RST.TP 27.94,13.35 29.52,14.93 | 29.52,14.93 R2.1 29.21,15.86 S1.1 | C6.1 29.21,15.24 29.52,14.93
RX1  (via drill 0.35)
  Top 0.254: R11.2 52.07,35.56 v50.8,34.29 | U$3.UART1_RX 43.85,15.91 44.58,16.64 v44.58,18.29
  Bottom 0.254: v50.8,34.29 50.8,24.51 v44.58,18.29 44.45,18.16 RX1.TP
RXLV
  Top 0.254: U7.14 38.28,41.96 38.28,42.63 38.44,42.79 46.96,42.79 R11.1
SCK
  Top 0.254: U3.5 18.32,44.36 17.74,44.95 13.6,44.95 13.24,44.59 13.24,42.85 13.4,42.69 14.1,42.69 24.99,31.8 24.99,22.69 27.05,20.63 31.69,20.63 32.48,19.84 U$3.PB23_SCK
SCL  (via drill 0.35)
  Top 0.152: U$3.SCL 42.51,31.08 v42.67,31.24 | v41.15,35.18 v41.16,35.19 U1.4
  Top 0.254: U4.4 2.75,30.41 2.75,23.59 6.02,20.32 v15.24,20.32 | U7.12 34.48,40.31 34.48,35.36 v38.1,31.74
  Bottom 0.152: v42.67,31.24 41.28,32.64 41.28,35.05 v41.15,35.18
  Bottom 0.254: SCL_1.TP SCL_2.TP 16.51,20.32 | 16.51,20.32 SCL_3.TP 16.51,24.78 R17.1 17.13,29.83 v17.78,30.48 19.96,32.66 23.7,32.66 24.06,33.02 SCL.TP | v15.24,20.32 16.51,20.32 | v41.15,35.18 38.1,32.13 v38.1,31.74 38.1,34.95 42.03,38.88 42.03,39.61 41.51,40.12 37.67,40.12 37.06,40.73 37.06,42.65 36.9,42.82 35.54,42.82 28.22,35.5 25.19,35.5 24.5,34.81 24.5,33.77 24.66,33.61 29.89,33.61 SCL.TP | U2.8 33.74,33.02 SCL.TP
SDA  (via drill 0.35)
  Top 0.152: U$3.SDA 41.31,31.66 43.31,33.66 U1.6
  Top 0.254: U4.3 3.41,30.32 3.15,30.07 3.15,23.76 5.32,21.59 v12.7,21.59 | U7.9 27.61,45.54 26.94,45.54 26.78,45.38 26.78,42.5 28.55,40.73 29.12,40.73 v31.75,38.1 27.94,34.29 27.94,32.68 28.6,32.02 28.6,31.48 27.94,30.82 v27.94,27.94 | v20.32,29.21 16.51,29.21 v15.24,30.48 | U1.6 43.2,34.46 42.95,34.22 40.71,34.22 38.1,36.83 v36.83,36.83
  Bottom 0.254: 13.97,21.59 SDA_2.TP SDA_1.TP 13.97,8.24 R14.1 | 13.97,21.59 SDA_3.TP 15.24,24.13 v15.24,30.48 | v12.7,21.59 13.97,21.59 | U2.1 34.29,35.17 34.29,38.1 | 34.29,38.1 34.29,39.37 36.83,39.37 SDA.TP v36.83,36.83 | v31.75,38.1 34.29,38.1 | v27.94,27.94 21.59,27.94 v20.32,29.21
SDO/ADR
  Top 0.254: R6.1 2.61,33.94 U4.5
TX1  (via drill 0.35)
  Top 0.152: U$3.UART1_TX 42.08,14.66 42.08,14.78 42.04,14.83 v42.04,18.29
  Top 0.254: R10.2 v49.53,34.29
  Bottom 0.152: v42.04,18.29 42.04,16.64 TX1.TP
  Bottom 0.254: v49.53,34.29 49.53,25.78 v42.04,18.29
TXLV
  Top 0.254: R10.1 47.5,37.68 44.85,40.33 44.05,40.33 43.09,39.37 35.56,39.37 U7.13
V_BATT  (via drill 0.35)
  Top 0.152: D3.A 30.48,13.97 31.75,13.97 31.75,15.24 30.61,16.38 C2.1
  Top 0.254: v21.59,12.7 14.55,12.7 14.54,12.69 12.69,12.69 +(P).1 6.7,13.62 6.35,14.12 6.35,17.78 +(P)1.1 | v30.48,12.7 30.48,13.97 | U5.3 34.29,11.78 v34.29,13.97
  Bottom 0.254: v21.59,12.7 26.2,12.7 27.43,11.47 29.17,11.47 29.21,11.43 v30.48,12.7 33.02,12.7 v34.29,13.97